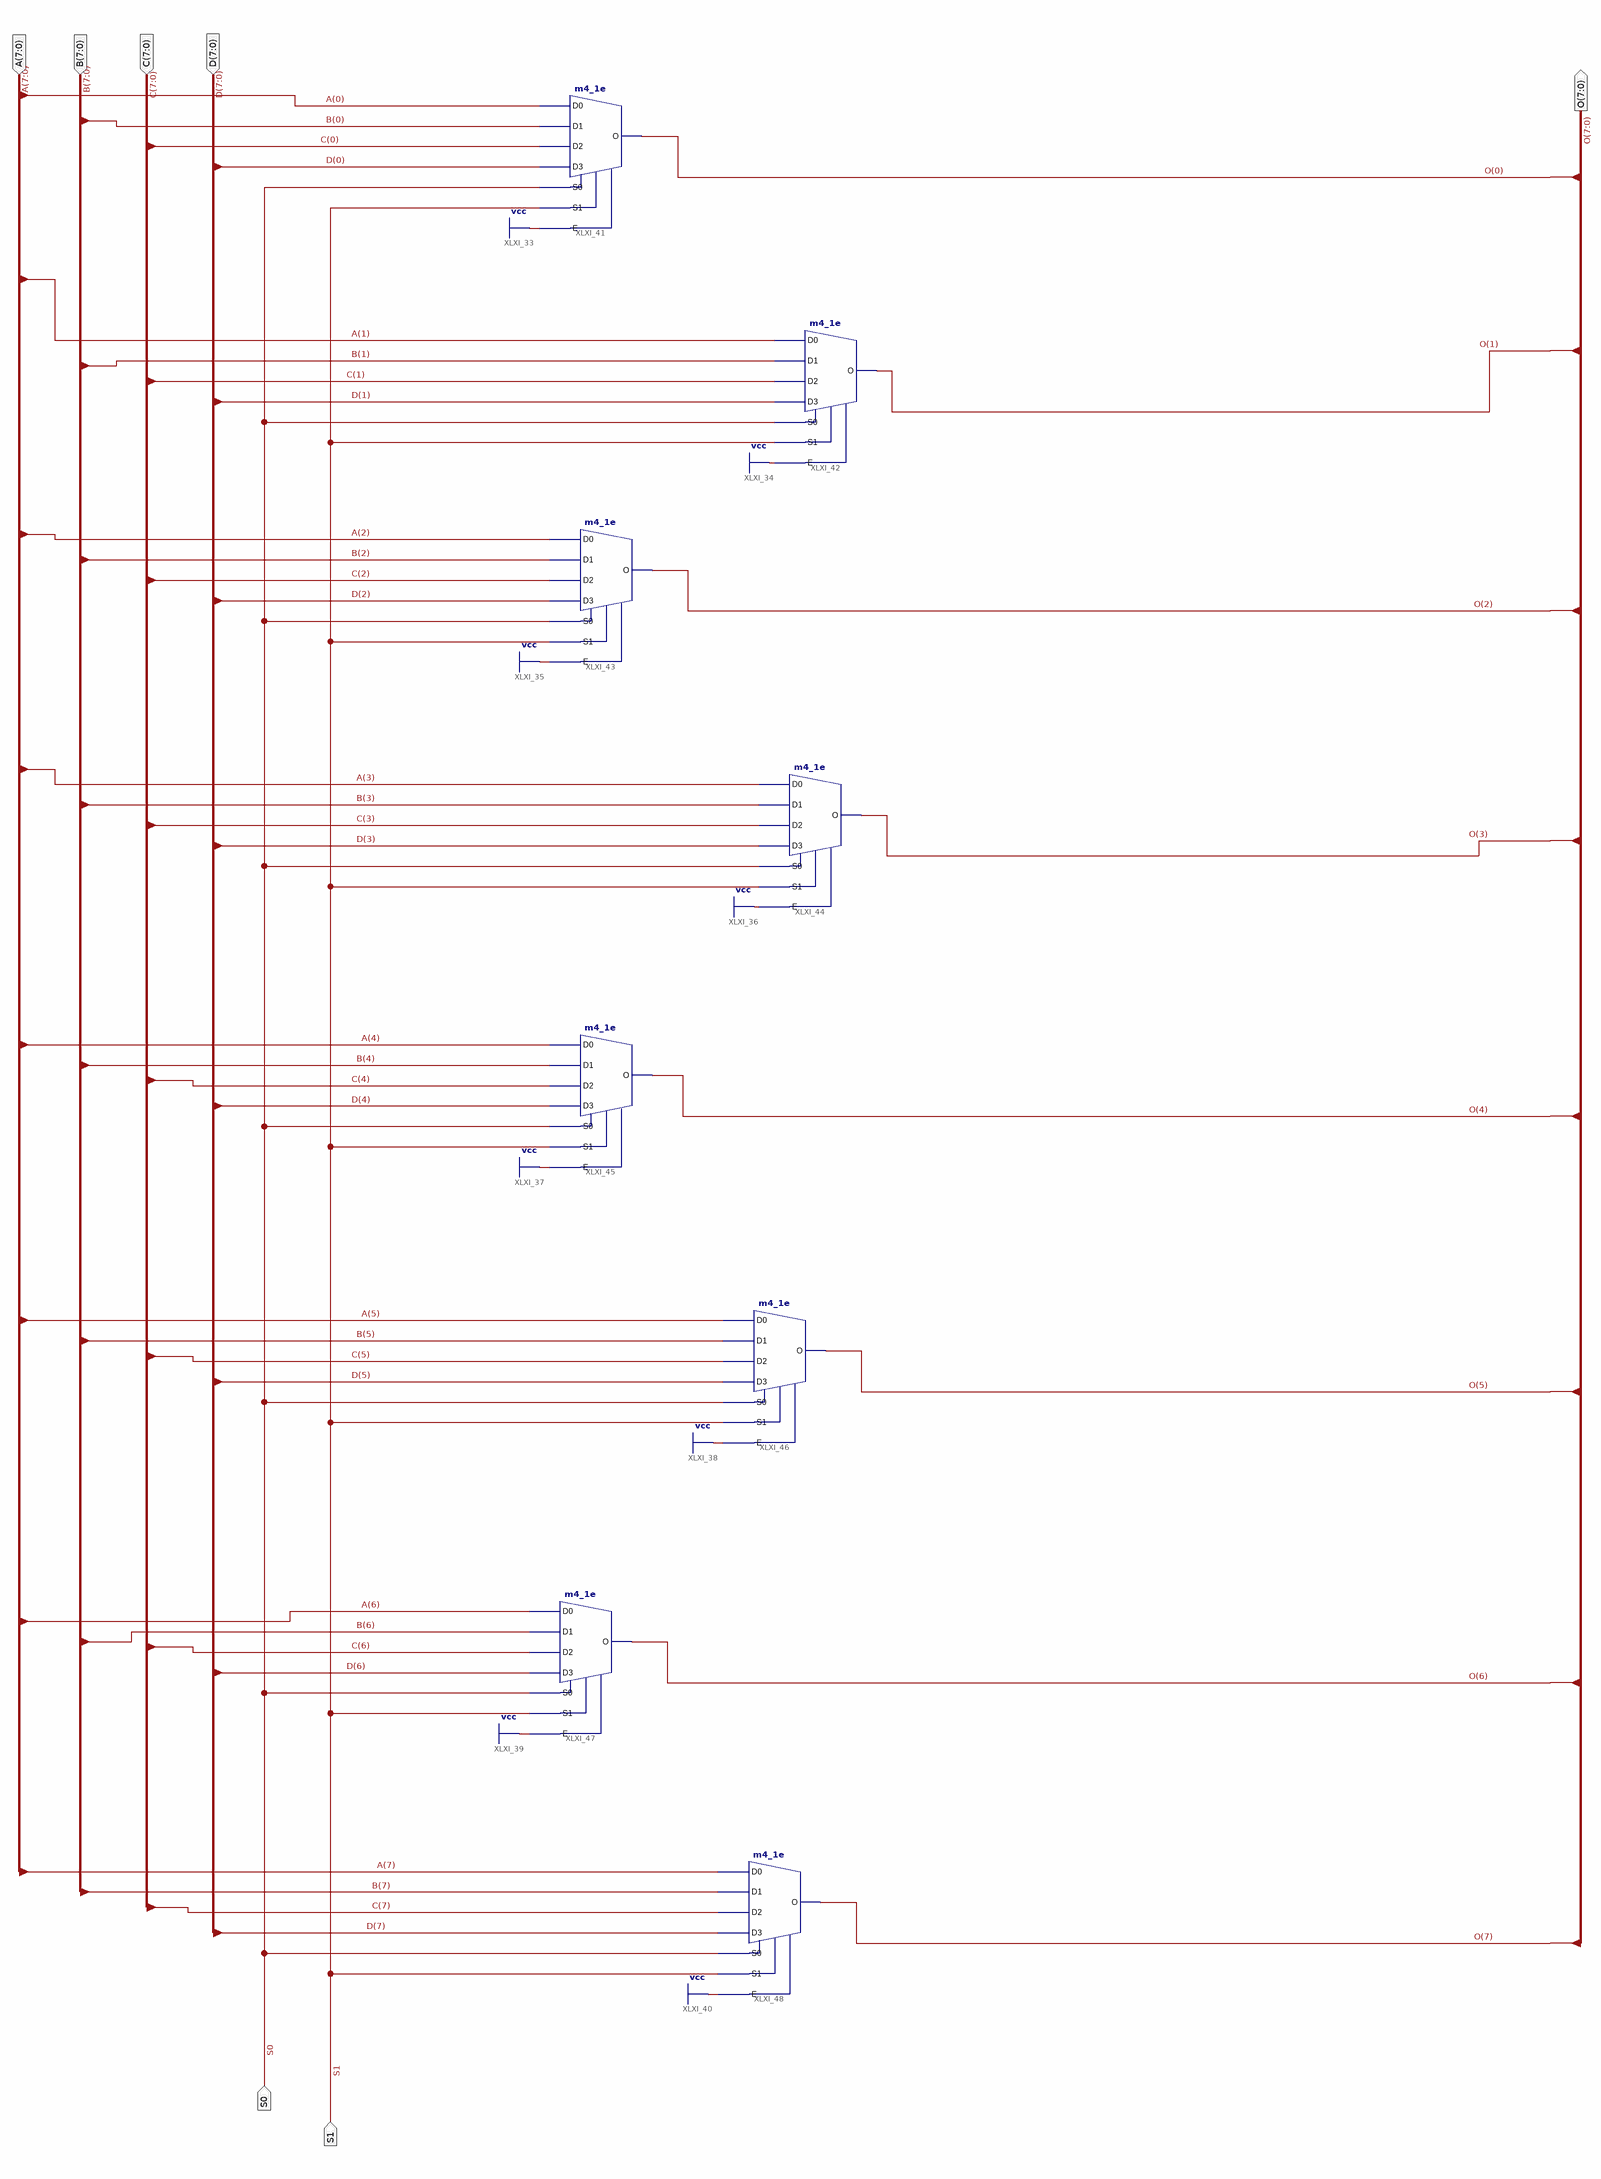
[diagram p0: schematic sheet 1]
// Xilinx ISE schematic decode32to8.sch (spartan6) as structural Verilog: 8 symbols, 7 ports
module decode32to8 (
  input  [7:0] A,
  input  [7:0] B,
  input  [7:0] C,
  input  [7:0] D,
  input  S0,
  input  S1,
  output [7:0] O
);

  m4_1e XLXI_41 (.D0(A[0]), .D1(B[0]), .D2(C[0]), .D3(D[0]), .E(1'b1), .S0(S0), .S1(S1), .O(O[0]));
  m4_1e XLXI_42 (.D0(A[1]), .D1(B[1]), .D2(C[1]), .D3(D[1]), .E(1'b1), .S0(S0), .S1(S1), .O(O[1]));
  m4_1e XLXI_43 (.D0(A[2]), .D1(B[2]), .D2(C[2]), .D3(D[2]), .E(1'b1), .S0(S0), .S1(S1), .O(O[2]));
  m4_1e XLXI_44 (.D0(A[3]), .D1(B[3]), .D2(C[3]), .D3(D[3]), .E(1'b1), .S0(S0), .S1(S1), .O(O[3]));
  m4_1e XLXI_45 (.D0(A[4]), .D1(B[4]), .D2(C[4]), .D3(D[4]), .E(1'b1), .S0(S0), .S1(S1), .O(O[4]));
  m4_1e XLXI_46 (.D0(A[5]), .D1(B[5]), .D2(C[5]), .D3(D[5]), .E(1'b1), .S0(S0), .S1(S1), .O(O[5]));
  m4_1e XLXI_47 (.D0(A[6]), .D1(B[6]), .D2(C[6]), .D3(D[6]), .E(1'b1), .S0(S0), .S1(S1), .O(O[6]));
  m4_1e XLXI_48 (.D0(A[7]), .D1(B[7]), .D2(C[7]), .D3(D[7]), .E(1'b1), .S0(S0), .S1(S1), .O(O[7]));
endmodule
